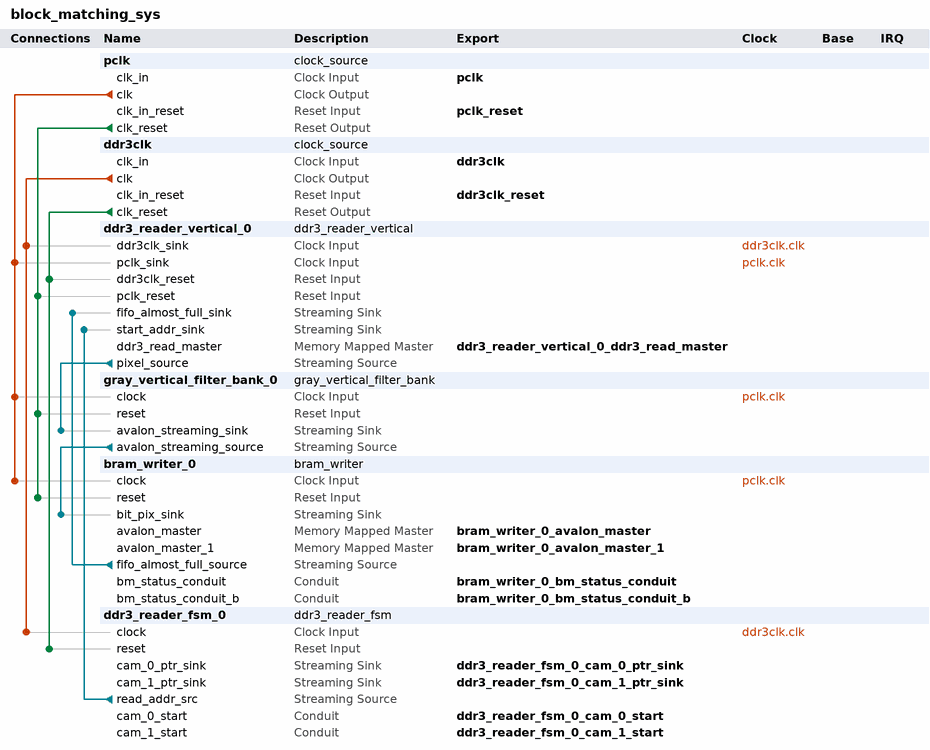
[diagram p0: system contents]
# Platform Designer (Qsys) system block_matching_sys, Cyclone V 5CSEBA6U23I7
# Parameters at their usual value, and those the tool derives, are not listed.
package require -exact qsys 18.1
create_system block_matching_sys
set_project_property DEVICE_FAMILY {Cyclone V}
set_project_property DEVICE 5CSEBA6U23I7

add_instance pclk clock_source 18.1
set_instance_parameter_value pclk clockFrequency 100000000
set_instance_parameter_value pclk resetSynchronousEdges BOTH

add_instance ddr3clk clock_source 18.1
set_instance_parameter_value ddr3clk clockFrequency 100000000
set_instance_parameter_value ddr3clk resetSynchronousEdges BOTH

add_instance ddr3_reader_vertical_0 ddr3_reader_vertical 1.0
set_instance_parameter_value ddr3_reader_vertical_0 burst_len 1
set_instance_parameter_value ddr3_reader_vertical_0 frame_full_width 768
set_instance_parameter_value ddr3_reader_vertical_0 frame_lines 480
set_instance_parameter_value ddr3_reader_vertical_0 frame_third_width 240
set_instance_parameter_value ddr3_reader_vertical_0 in_width 16

add_instance gray_vertical_filter_bank_0 gray_vertical_filter_bank 1.0
set_instance_parameter_value gray_vertical_filter_bank_0 frame_lines 480
set_instance_parameter_value gray_vertical_filter_bank_0 n_filters 16
set_instance_parameter_value gray_vertical_filter_bank_0 radius 8

add_instance bram_writer_0 bram_writer 1.0
set_instance_parameter_value bram_writer_0 num_pix 16
set_instance_parameter_value bram_writer_0 test_mode 0
set_instance_parameter_value bram_writer_0 third_cols 240
set_instance_parameter_value bram_writer_0 third_rows 480

add_instance ddr3_reader_fsm_0 ddr3_reader_fsm 1.0
set_instance_parameter_value ddr3_reader_fsm_0 test_mode 1

# connections
add_connection ddr3clk.clk ddr3_reader_fsm_0.clock clock
add_connection ddr3clk.clk ddr3_reader_vertical_0.ddr3clk_sink clock
add_connection pclk.clk bram_writer_0.clock clock
add_connection pclk.clk ddr3_reader_vertical_0.pclk_sink clock
add_connection pclk.clk gray_vertical_filter_bank_0.clock clock
add_connection ddr3clk.clk_reset ddr3_reader_fsm_0.reset reset
add_connection ddr3clk.clk_reset ddr3_reader_vertical_0.ddr3clk_reset reset
add_connection pclk.clk_reset bram_writer_0.reset reset
add_connection pclk.clk_reset ddr3_reader_vertical_0.pclk_reset reset
add_connection pclk.clk_reset gray_vertical_filter_bank_0.reset reset
add_connection bram_writer_0.fifo_almost_full_source ddr3_reader_vertical_0.fifo_almost_full_sink avalon_streaming
add_connection ddr3_reader_fsm_0.read_addr_src ddr3_reader_vertical_0.start_addr_sink avalon_streaming
add_connection ddr3_reader_vertical_0.pixel_source gray_vertical_filter_bank_0.avalon_streaming_sink avalon_streaming
add_connection gray_vertical_filter_bank_0.avalon_streaming_source bram_writer_0.bit_pix_sink avalon_streaming

# exported interfaces
add_interface bram_writer_0_avalon_master avalon master
set_interface_property bram_writer_0_avalon_master EXPORT_OF bram_writer_0.avalon_master
add_interface bram_writer_0_avalon_master_1 avalon master
set_interface_property bram_writer_0_avalon_master_1 EXPORT_OF bram_writer_0.avalon_master_1
add_interface bram_writer_0_bm_status_conduit conduit end
set_interface_property bram_writer_0_bm_status_conduit EXPORT_OF bram_writer_0.bm_status_conduit
add_interface bram_writer_0_bm_status_conduit_b conduit end
set_interface_property bram_writer_0_bm_status_conduit_b EXPORT_OF bram_writer_0.bm_status_conduit_b
add_interface ddr3_reader_fsm_0_cam_0_ptr_sink avalon_streaming sink
set_interface_property ddr3_reader_fsm_0_cam_0_ptr_sink EXPORT_OF ddr3_reader_fsm_0.cam_0_ptr_sink
add_interface ddr3_reader_fsm_0_cam_0_start conduit end
set_interface_property ddr3_reader_fsm_0_cam_0_start EXPORT_OF ddr3_reader_fsm_0.cam_0_start
add_interface ddr3_reader_fsm_0_cam_1_ptr_sink avalon_streaming sink
set_interface_property ddr3_reader_fsm_0_cam_1_ptr_sink EXPORT_OF ddr3_reader_fsm_0.cam_1_ptr_sink
add_interface ddr3_reader_fsm_0_cam_1_start conduit end
set_interface_property ddr3_reader_fsm_0_cam_1_start EXPORT_OF ddr3_reader_fsm_0.cam_1_start
add_interface ddr3_reader_vertical_0_ddr3_read_master avalon master
set_interface_property ddr3_reader_vertical_0_ddr3_read_master EXPORT_OF ddr3_reader_vertical_0.ddr3_read_master
add_interface ddr3clk clock sink
set_interface_property ddr3clk EXPORT_OF ddr3clk.clk_in
add_interface ddr3clk_reset reset sink
set_interface_property ddr3clk_reset EXPORT_OF ddr3clk.clk_in_reset
add_interface pclk clock sink
set_interface_property pclk EXPORT_OF pclk.clk_in
add_interface pclk_reset reset sink
set_interface_property pclk_reset EXPORT_OF pclk.clk_in_reset

set_interconnect_requirement {$system} qsys_mm.clockCrossingAdapter HANDSHAKE
set_interconnect_requirement {$system} qsys_mm.enableEccProtection FALSE
set_interconnect_requirement {$system} qsys_mm.insertDefaultSlave FALSE
set_interconnect_requirement {$system} qsys_mm.maxAdditionalLatency 1

save_system block_matching_sys.qsys
